# Altium schematic sheet Sheet_AD_inputs_connectors.SchDoc: A/D inputs connectors
size A4; Organization: Altium Limited; Address1: L3, 12a Rodborough Rd; Address2: Frenchs Forest; Address3: NSW; Address4: Australia 2086
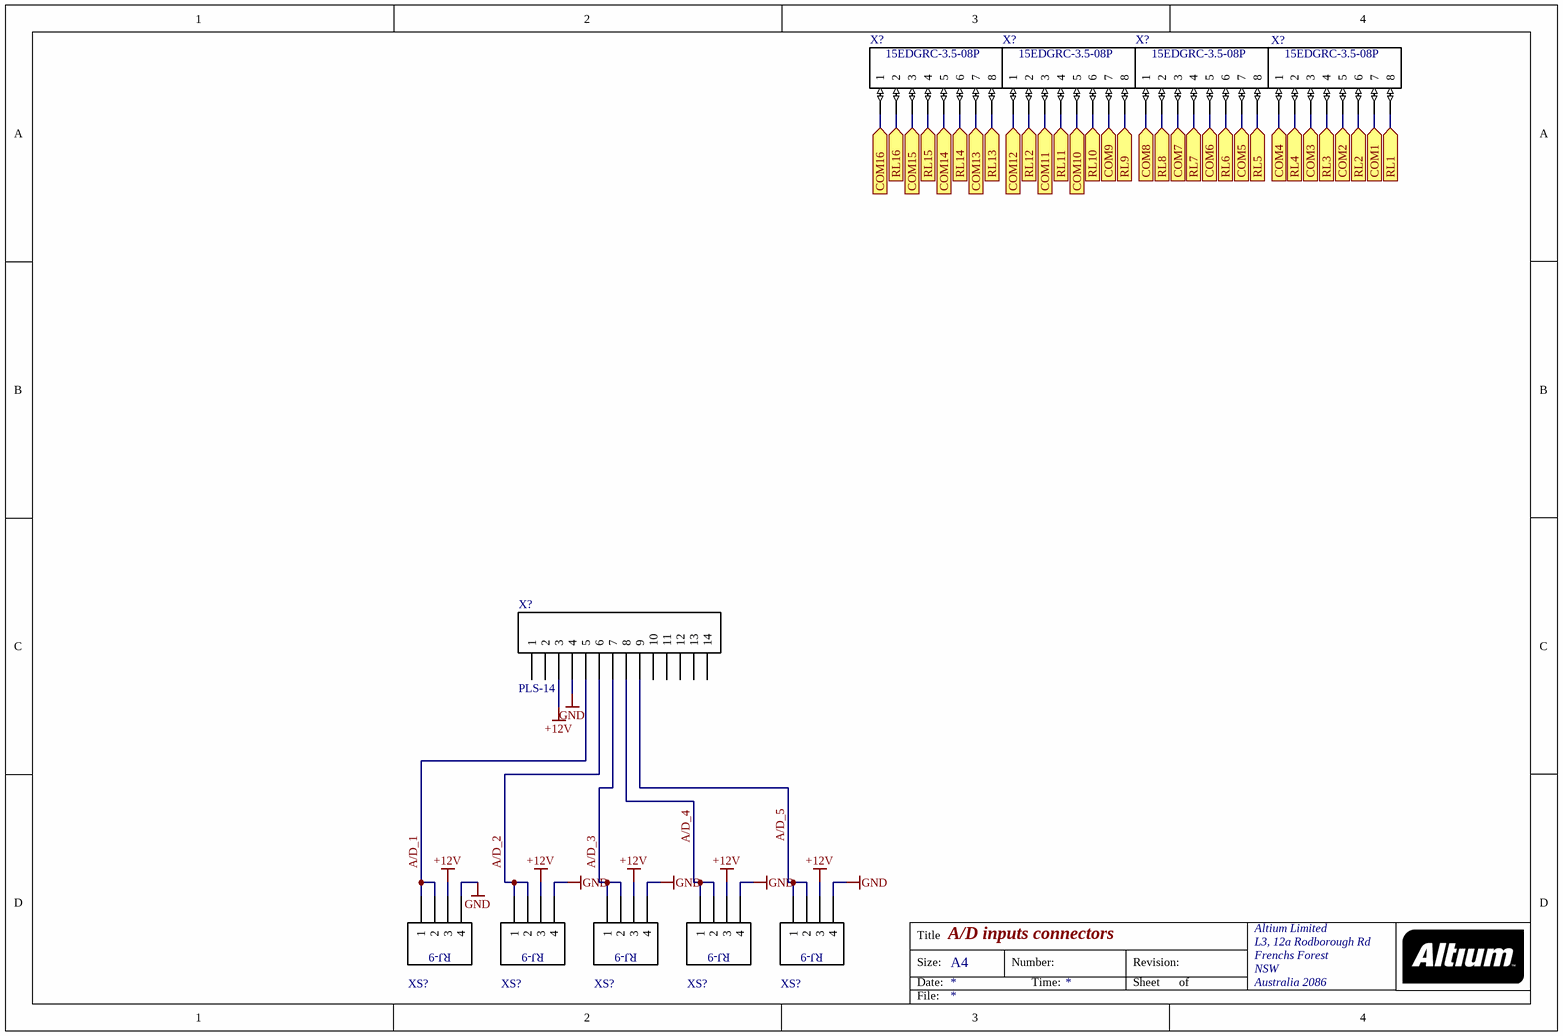
[diagram p0: Sheet_AD_inputs_connectors.SchDoc]

## Parts
(Parts that share a designator on the sheet are numbered #1, #2 ... from top to bottom, then left to right.)
X?#1  15EDGRC-3.5-08P  [MC_3.5_8]
X?#2  15EDGRC-3.5-08P  [MC_3.5_8]
X?#3  15EDGRC-3.5-08P  [MC_3.5_8]
X?#4  15EDGRC-3.5-08P  [MC_3.5_8]
X?#5  PLS-14  [PLS-14RL-3D]
XS?#1  RJ-9_Simple  [RJ-9 - YH-52-01]  (value not drawn)
XS?#2  RJ-9_Simple  [RJ-9 - YH-52-01]  (value not drawn)
XS?#3  RJ-9_Simple  [RJ-9 - YH-52-01]  (value not drawn)
XS?#4  RJ-9_Simple  [RJ-9 - YH-52-01]  (value not drawn)
XS?#5  RJ-9_Simple  [RJ-9 - YH-52-01]  (value not drawn)

## Ports
COM1 (in), COM2 (in), COM3 (in), COM4 (in), COM5 (in), COM6 (in), COM7 (in), COM8 (in), COM9 (in), COM10 (in), COM11 (in), COM12 (in), COM13 (in), COM14 (in), COM15 (in), COM16 (in), RL1 (in), RL2 (in), RL3 (in), RL4 (in), RL5 (in), RL6 (in), RL7 (in), RL8 (in), RL9 (in), RL10 (in), RL11 (in), RL12 (in), RL13 (in), RL14 (in), RL15 (in), RL16 (in)

## Nets
+12V: X?#5.3 XS?#1.3 XS?#2.3 XS?#3.3 XS?#4.3 XS?#5.3
GND: X?#5.4 XS?#1.4 XS?#2.4 XS?#3.4 XS?#4.4 XS?#5.4
A/D_1: X?#5.5 XS?#1.1 XS?#1.2
A/D_2: X?#5.6 XS?#2.1 XS?#2.2
A/D_3: X?#5.7 XS?#3.1 XS?#3.2
A/D_4: X?#5.8 XS?#4.1 XS?#4.2
A/D_5: X?#5.9 XS?#5.1 XS?#5.2
COM1: X?#4.7 ; port COM1
COM2: X?#4.5 ; port COM2
COM3: X?#4.3 ; port COM3
COM4: X?#4.1 ; port COM4
COM5: X?#3.7 ; port COM5
COM6: X?#3.5 ; port COM6
COM7: X?#3.3 ; port COM7
COM8: X?#3.1 ; port COM8
COM9: X?#2.7 ; port COM9
COM10: X?#2.5 ; port COM10
COM11: X?#2.3 ; port COM11
COM12: X?#2.1 ; port COM12
COM13: X?#1.7 ; port COM13
COM14: X?#1.5 ; port COM14
COM15: X?#1.3 ; port COM15
COM16: X?#1.1 ; port COM16
RL1: X?#4.8 ; port RL1
RL2: X?#4.6 ; port RL2
RL3: X?#4.4 ; port RL3
RL4: X?#4.2 ; port RL4
RL5: X?#3.8 ; port RL5
RL6: X?#3.6 ; port RL6
RL7: X?#3.4 ; port RL7
RL8: X?#3.2 ; port RL8
RL9: X?#2.8 ; port RL9
RL10: X?#2.6 ; port RL10
RL11: X?#2.4 ; port RL11
RL12: X?#2.2 ; port RL12
RL13: X?#1.8 ; port RL13
RL14: X?#1.6 ; port RL14
RL15: X?#1.4 ; port RL15
RL16: X?#1.2 ; port RL16

Not connected (* = marked no-connect by the designer): X?#5 1 2 10 11 12 13 14

## Notes on the sheet
- Title
- Size:
- Date:
- A4
- Number:
- Time:
- Revision:
- Sheet
- of
- File:
- (in symbol RJ-9_Simple) RJ-9

## Library data of the parts
X?#1-X?#4 = MC_3.5_8: Connector 3.5mm
X?#5 = PLS-14: Header, 14-Pin; LatestRevisionDate: 17-Jul-2002; LatestRevisionNote: Re-released for DXP Platform.; Publisher: Altium Limited